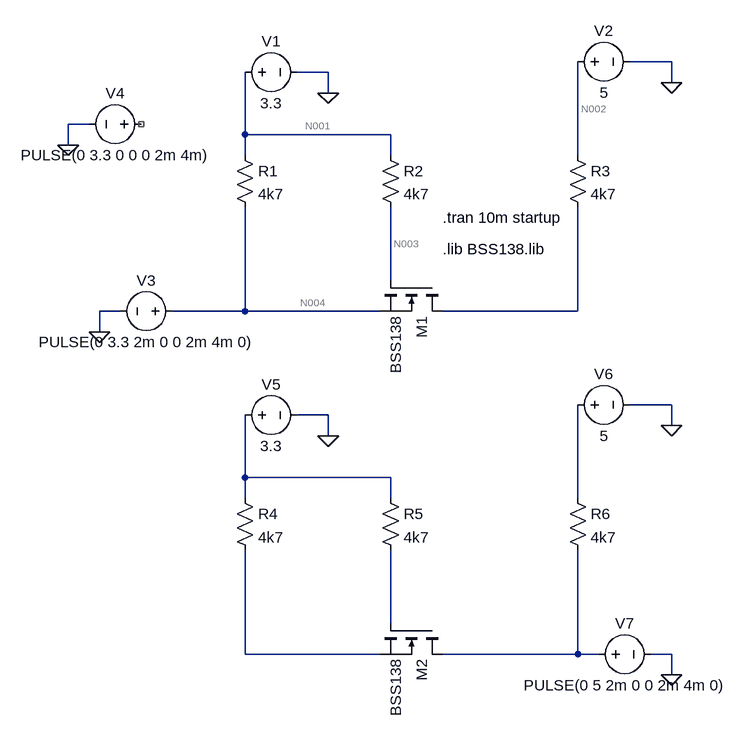
[diagram p0: schematic Draft1.asc]
Draft1.asc, the LTspice schematic file:
Version 4
SHEET 1 880 864
WIRE 720 -160 656 -160
WIRE 192 -144 144 -144
WIRE 720 -128 720 -160
WIRE 192 -112 192 -144
WIRE -176 -64 -208 -64
WIRE 64 -48 64 -144
WIRE 288 -48 64 -48
WIRE -208 -32 -208 -64
WIRE 64 -16 64 -48
WIRE 288 -16 288 -48
WIRE 576 -16 576 -160
WIRE 288 176 288 64
WIRE -128 224 -160 224
WIRE 64 224 64 64
WIRE 64 224 -48 224
WIRE 272 224 64 224
WIRE 576 224 576 64
WIRE 576 224 368 224
WIRE -160 256 -160 224
WIRE 720 368 656 368
WIRE 192 384 144 384
WIRE 720 400 720 368
WIRE 192 416 192 384
WIRE 64 480 64 384
WIRE 288 480 64 480
WIRE 64 512 64 480
WIRE 288 512 288 480
WIRE 576 512 576 368
WIRE 288 704 288 592
WIRE 64 752 64 592
WIRE 272 752 64 752
WIRE 576 752 576 592
WIRE 576 752 368 752
WIRE 608 752 576 752
WIRE 720 752 688 752
WIRE 720 784 720 752
FLAG 192 -112 0
FLAG 720 -128 0
FLAG -160 256 0
FLAG -208 -32 0
FLAG 192 416 0
FLAG 720 400 0
FLAG 720 784 0
SYMBOL nmos 368 176 R90
SYMATTR InstName M1
SYMATTR Value BSS138
SYMATTR Prefix X
SYMBOL res 48 -32 R0
SYMATTR InstName R1
SYMATTR Value 4k7
SYMBOL res 272 -32 R0
SYMATTR InstName R2
SYMATTR Value 4k7
SYMBOL res 560 -32 R0
SYMATTR InstName R3
SYMATTR Value 4k7
SYMBOL voltage 48 -144 M90
WINDOW 0 -32 56 VBottom 2
WINDOW 3 32 56 VTop 2
WINDOW 123 0 0 Left 2
WINDOW 39 0 0 Left 2
SYMATTR InstName V1
SYMATTR Value 3.3
SYMBOL voltage 560 -160 M90
WINDOW 0 -32 56 VBottom 2
WINDOW 3 32 56 VTop 2
WINDOW 123 0 0 Left 2
WINDOW 39 0 0 Left 2
SYMATTR InstName V2
SYMATTR Value 5
SYMBOL voltage -32 224 R90
WINDOW 0 -32 56 VBottom 2
WINDOW 3 32 56 VTop 2
WINDOW 123 0 0 Left 2
WINDOW 39 0 0 Left 2
SYMATTR InstName V3
SYMATTR Value PULSE(0 3.3 2m 0 0 2m 4m 0)
SYMBOL voltage -80 -64 R90
WINDOW 0 -32 56 VBottom 2
WINDOW 3 32 56 VTop 2
WINDOW 123 0 0 Left 2
WINDOW 39 0 0 Left 2
SYMATTR InstName V4
SYMATTR Value PULSE(0 3.3 0 0 0 2m 4m)
SYMBOL nmos 368 704 R90
SYMATTR InstName M2
SYMATTR Value BSS138
SYMATTR Prefix X
SYMBOL res 48 496 R0
SYMATTR InstName R4
SYMATTR Value 4k7
SYMBOL res 272 496 R0
SYMATTR InstName R5
SYMATTR Value 4k7
SYMBOL res 560 496 R0
SYMATTR InstName R6
SYMATTR Value 4k7
SYMBOL voltage 48 384 M90
WINDOW 0 -32 56 VBottom 2
WINDOW 3 32 56 VTop 2
WINDOW 123 0 0 Left 2
WINDOW 39 0 0 Left 2
SYMATTR InstName V5
SYMATTR Value 3.3
SYMBOL voltage 560 368 M90
WINDOW 0 -32 56 VBottom 2
WINDOW 3 32 56 VTop 2
WINDOW 123 0 0 Left 2
WINDOW 39 0 0 Left 2
SYMATTR InstName V6
SYMATTR Value 5
SYMBOL voltage 592 752 M90
WINDOW 0 -32 56 VBottom 2
WINDOW 3 32 56 VTop 2
WINDOW 123 0 0 Left 2
WINDOW 39 0 0 Left 2
SYMATTR InstName V7
SYMATTR Value PULSE(0 5 2m 0 0 2m 4m 0)
TEXT 368 128 Left 2 !.lib BSS138.lib
TEXT 368 80 Left 2 !.tran 10m startup

The netlist it stands for:
* Draft1.asc
XM1 N005 N003 N004 BSS138  ; pins D G S
R1 N001 N004 4k7
R2 N001 N003 4k7
R3 N002 N005 4k7
V1 N001 0 3.3
V2 N002 0 5
V3 N004 0 PULSE(0 3.3 2m 0 0 2m 4m 0)
V4 NC_01 0 PULSE(0 3.3 0 0 0 2m 4m)
XM2 N010 N008 N009 BSS138  ; pins D G S
R4 N006 N009 4k7
R5 N006 N008 4k7
R6 N007 N010 4k7
V5 N006 0 3.3
V6 N007 0 5
V7 N010 0 PULSE(0 5 2m 0 0 2m 4m 0)
.lib BSS138.lib
.tran 10m startup
.backanno
.end

* Results of the author's LTspice run, read from the files saved beside the schematic
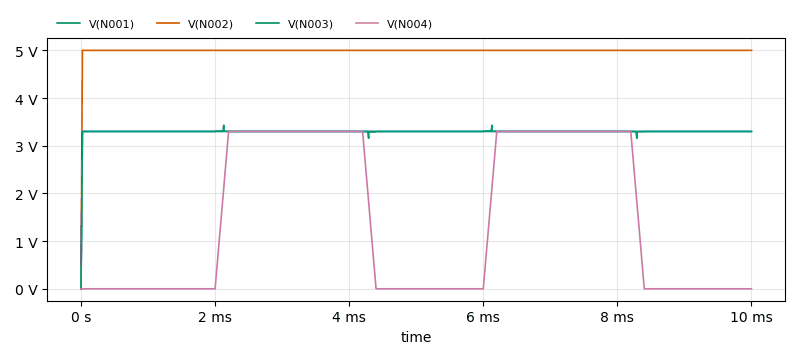
[diagram p1: Transient Analysis of Draft1.asc, plotted from the saved traces]
* Transient Analysis, 1 run:
*   V(N001): min 0 V, max 3.3 V, average 3.297 V, rms 3.298 V, last 3.3 V
*   V(N002): min 0 V, max 5 V, average 4.995 V, rms 4.997 V, last 5 V
*   V(N003): min 0 V, max 3.431 V, average 3.296 V, rms 3.297 V, last 3.298 V
*   V(N004): min 0 V, max 3.3 V, average 1.452 V, rms 2.156 V, last 0 V